# EasyEDA schematic 1-Schematic_dra-30-vox.json
TITLE: Sheet_1; REV: 1.0; Date: 2021-01-22; Sheet: 1/1; Drawn By: battman; Company: Your Company
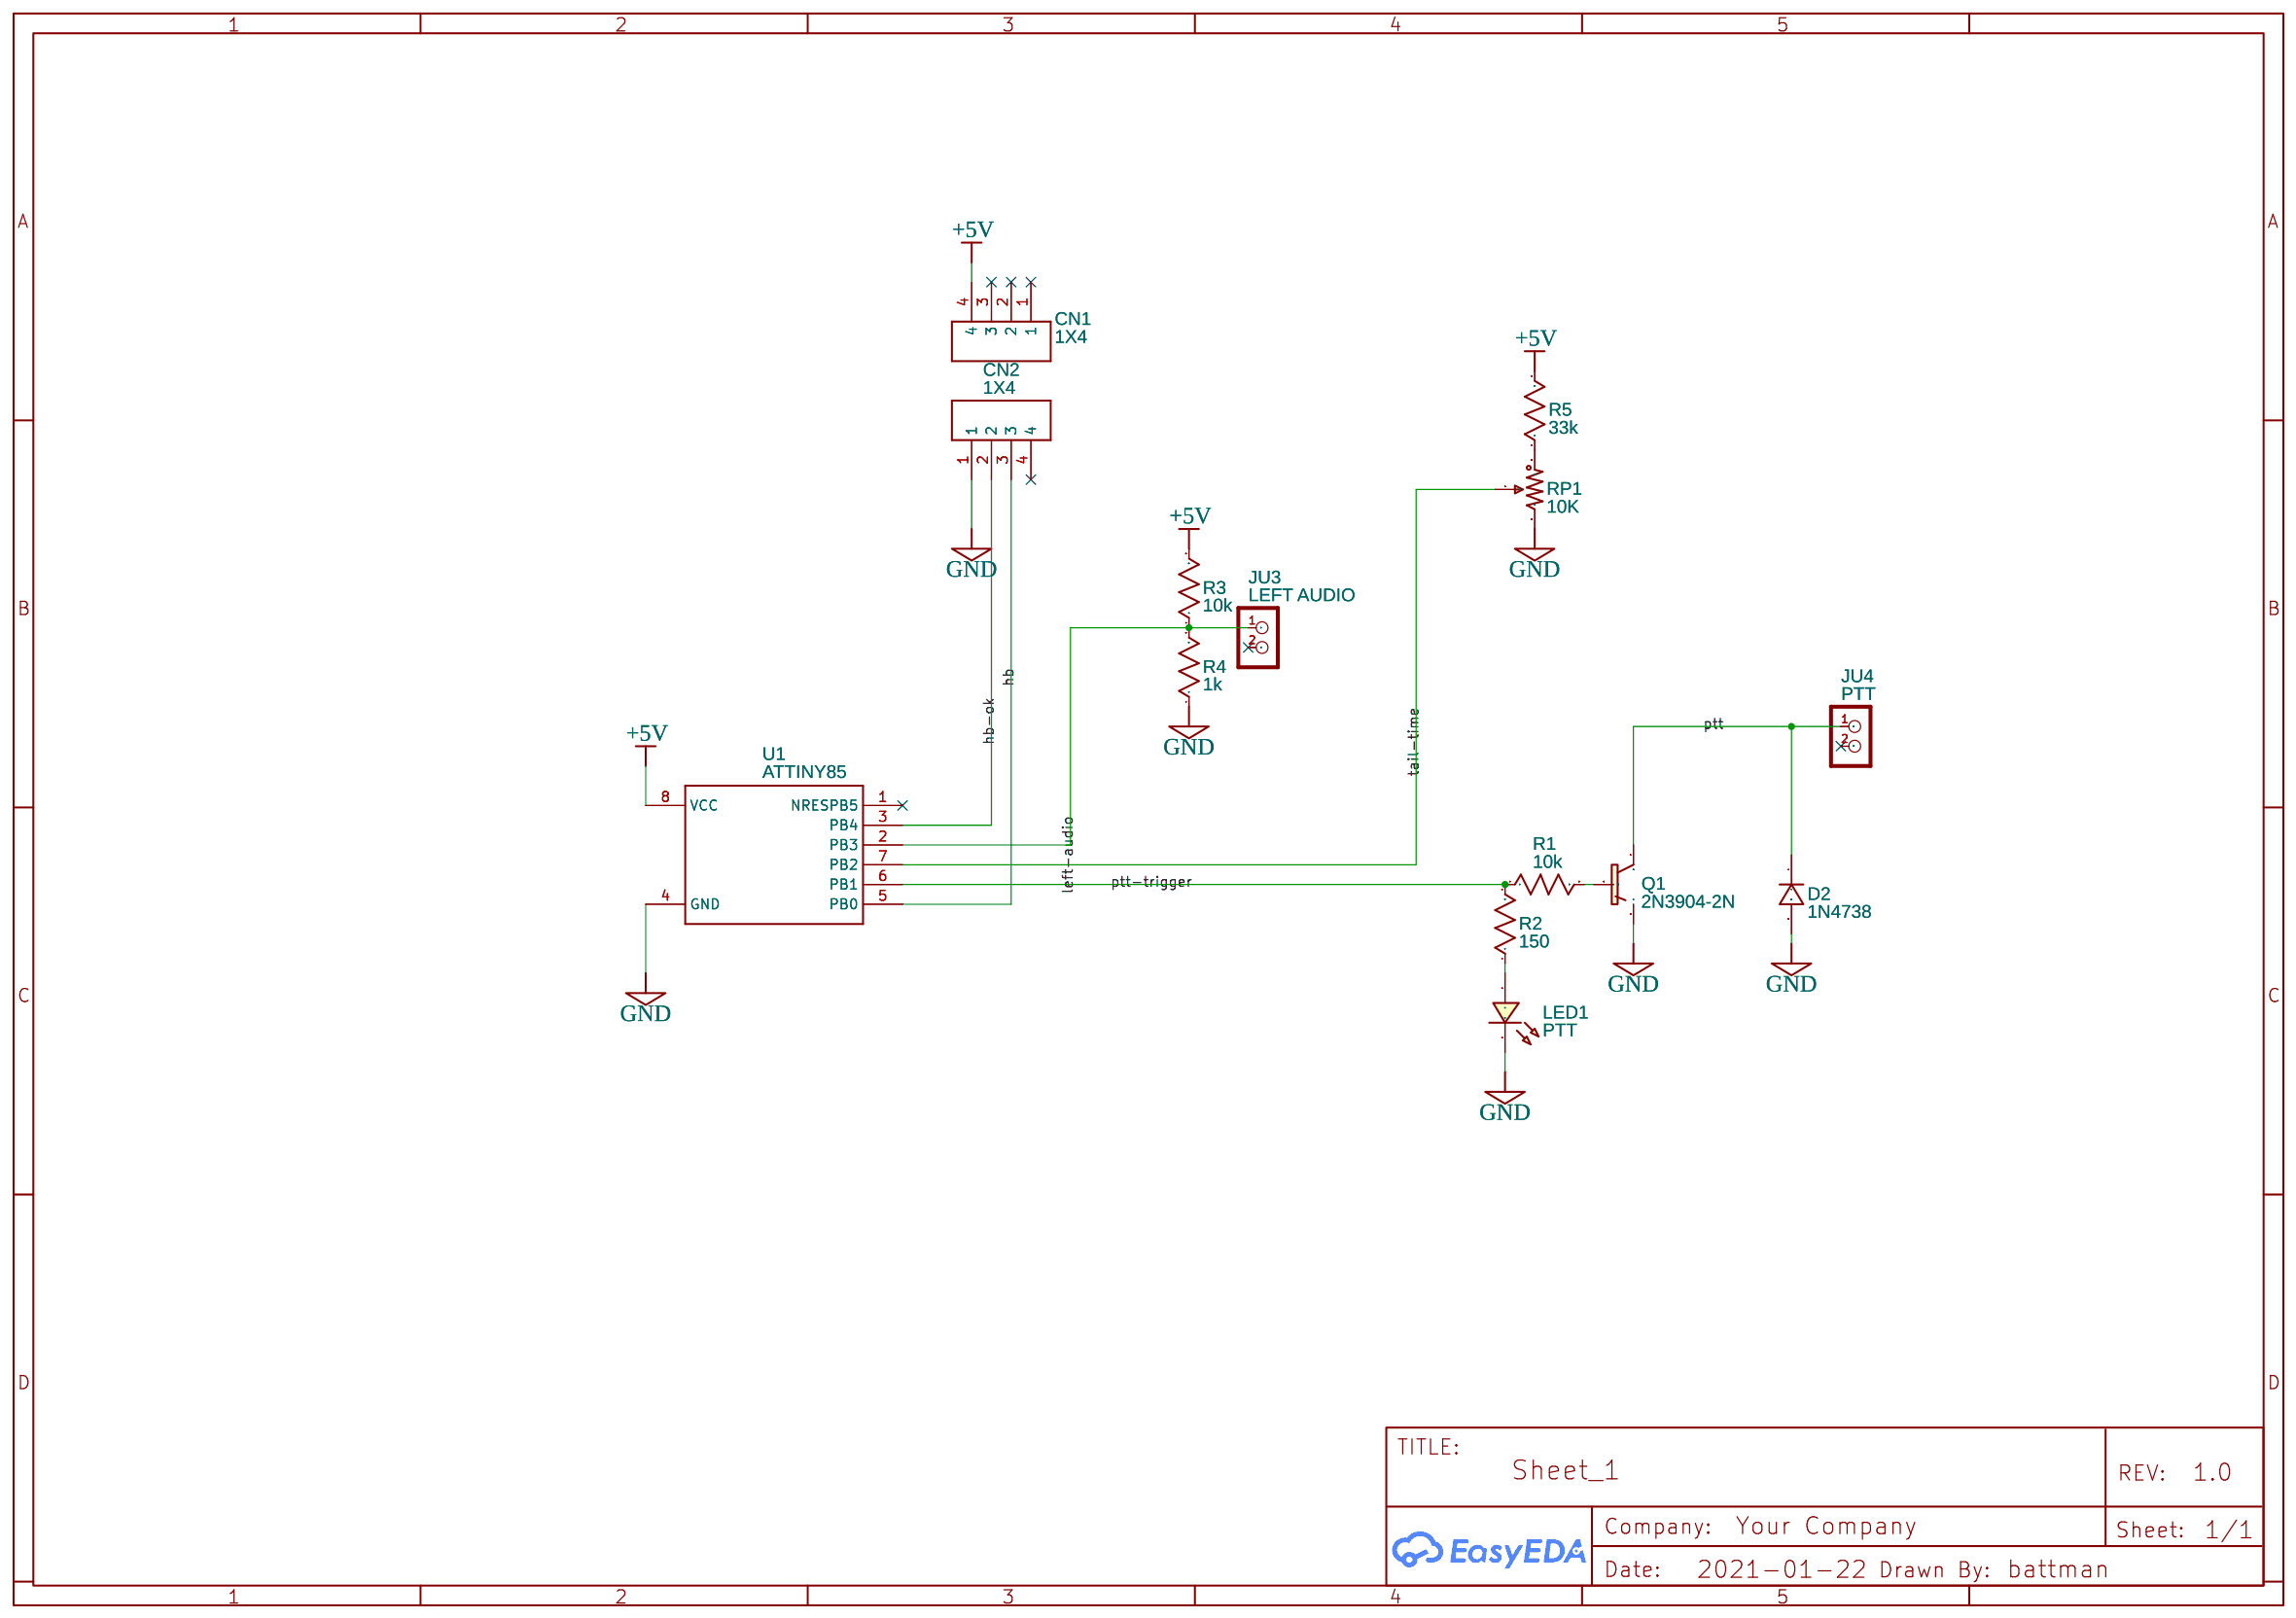
[diagram p0: schematic sheet]

## Parts
CN1  1X4  [1X04-BIG]
CN2  1X4  [1X04-BIG]
D2  1N4738  [DO-41_BD2.4-L4.7-P8.70-D0.9-RD]
JU3  LEFT AUDIO  [M1X2]
JU4  PTT  [M1X2]
LED1  PTT  [LED-TH_BD5.0_RED]
Q1  2N3904-2N  [TO92]
R1  10k  [R_AXIAL-0.3]
R2  150  [R_AXIAL-0.3]
R3  10k  [R_AXIAL-0.3]
R4  1k  [R_AXIAL-0.3]
R5  33k  [R_AXIAL-0.3]
RP1  10K  [RES-ADJ-TH_3386P]
U1  ATTINY85  [PDIP08_300MIL]

## Library data of the parts
CN1 CN2 = 1X4: Contributor: Adafruit
D2 = 1N4007: Supplier: LCSC; Manufacturer: SEMTECH; Supplier Part: C106903; Contributor: LCEDA_Lib
JU3 JU4 = CON_HEADER_1X02-PTH: Contributor: DangerousPrototype
LED1 = LED-TH-5mm_R: Manufacturer: EVERLIGHT(台湾亿光); Manufacturer Part: 333-2SURD/S530-A3; Supplier Part: C87271; Supplier: LCSC; Contributor: LCEDA_Lib
Q1 = 2N3904-2N
R1-R5 = R_AXIAL-0.3_US: Contributor: LCEDA_Lib
RP1 = R_3386P_US: Supplier: LCSC; Contributor: LCEDA_Lib
U1 = ATTINY85V-10P

## Nets
+5V: CN1.4 R3.2 R5.2 U1.8(VCC)
GND: CN2.1 D2.2 LED1.2 Q1.3(E) R4.1 RP1.3 U1.4(GND)
hb: CN2.3 U1.5(PB0)
hb-ok: CN2.2 U1.3(PB4)
left-audio: JU3.1 R3.1 R4.2 U1.2(PB3)
ptt: D2.1 JU4.1 Q1.1(C)
ptt-trigger: R1.1 R2.2 U1.6(PB1)
tail-time: RP1.2 U1.7(PB2)
Net-(LED1-1): LED1.1 R2.1
Net-(Q1-2): Q1.2(B) R1.2
Net-(R5-1): R5.1 RP1.1

Not connected (* = marked no-connect by the designer): CN1 1* 2* 3*; CN2 4*; JU3 2*; JU4 2*; U1 1(NRESPB5)*
